# Altium schematic sheet NoiseSource.SchDoc: =prj_title
size A4; Organization1: Sciences of Technology Buchs; CheckedBy: tbd; CompanyName: OST; Organization: OST Ostschweizer Fachhochschule; Address1: Werdenbergstrasse 4; Address2: 9471 Buchs; Address3: Switzerland; SheetNumber: 1; SheetTotal: 1; Size: A4; ShortDescription: 16 GHz Noise Source
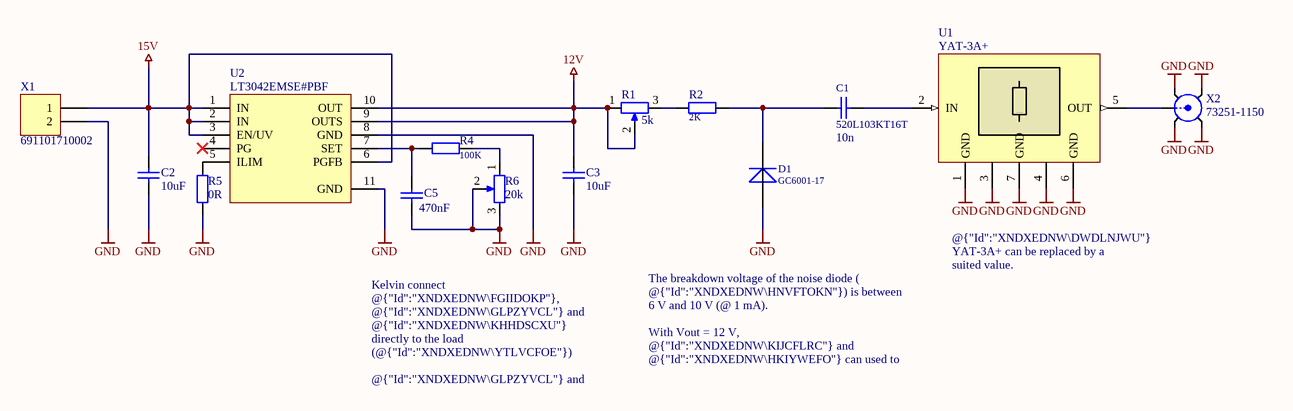
[diagram p0: NoiseSource.SchDoc]

## Parts
C1  520L103KT16T  ShortDescription: 10n  [CAP-0402[1005] - RFL]
C2  ShortDescription: 10uF  [Generic_Cap0603_2_RW]  (hidden comment: GRM188R61E106KA73D)
C3  ShortDescription: 10uF  [Generic_Cap0603_2_RW]  (hidden comment: GRM188R61E106KA73D)
C5  ShortDescription: 470nF  [Generic_Cap0603_2_RW]  (hidden comment: UMK107B7474KA-TR)
D1  GC6001-17  [Microsemi_GC6001-17_2]
R1  ShortDescription: 5k  [BOURNS_3312_3]  (hidden comment: 3312J-1-502E)
R2  value 2K  [RES-0603[1608] - RFL]  (hidden comment: 2K 1% 0603(1608))
R4  value 100K  [RES-0603[1608] - RFL]  (hidden comment: 100K 1% 0603(1608))
R5  0R  [Generic_Res0603_2_RW]
R6  ShortDescription: 20k  [BOURNS_3312_3]  (hidden comment: 3312J-1-203E)
U1  YAT-3A+  [MiniCircuit_MC1630_R]
U2  LT3042EMSE#PBF  [ANALOG_MSOP10_11]
X1  691101710002  [WURTH_691101710002_2_RWH]
X2  73251-1150  [Amphenol_SMA-EDGE-MOUNT_3_H]

## Nets
12V: C3.2 R1.1(TOP) R1.2(TAP) U2.9(OUTS) U2.10(OUT)
15V: C2.2 U2.1(IN) U2.2(IN) U2.3(EN/UV) U2.6(PGFB) X1.1
GND: C2.1 C3.1 C5.2 D1.2(A) R5.2 R6.2(TAP) R6.3(BOT) U1.1(GND) U1.3(GND) U1.4(GND) U1.6(GND) U1.7(GND) U2.8(GND) U2.11(GND) X1.2 X2.2 X2.3 X2.4 X2.5
NetC1_1: C1.1 U1.2(IN)
NetC1_2: C1.2 D1.1(K) R2.1
NetC5_1: C5.1 R4.1 U2.7(SET)
NetR1_3: R1.3(BOT) R2.2
NetR4_2: R4.2 R6.1(TOP)
NetR5_1: R5.1 U2.5(ILIM)
NetU1_5: U1.5(OUT) X2.1

Not connected (* = marked no-connect by the designer): U2 4(PG)*

## Notes on the sheet
- @{"Id":"XNDXEDNW\DWDLNJWU"}  YAT-3A+ can be replaced by a suited value.
- Kelvin connect @{"Id":"XNDXEDNW\FGIIDOKP"}, @{"Id":"XNDXEDNW\GLPZYVCL"} and @{"Id":"XNDXEDNW\KHHDSCXU"} directly to the load (@{"Id":"XNDXEDNW\YTLVCFOE"})
  @{"Id":"XNDXEDNW\GLPZYVCL"} and @{"Id":"XNDXEDNW\KHHDSCXU"} can adjust the output voltage between 10 V and 12 V
  Vout = 100 uA * (@{"Id":"XNDXEDNW\GLPZYVCL"} + @{"Id":"XNDXEDNW\KHHDSCXU"})
- The breakdown voltage of the noise diode ( @{"Id":"XNDXEDNW\HNVFTOKN"}) is between 6 V and 10 V (@ 1 mA).
  With Vout = 12 V, @{"Id":"XNDXEDNW\KIJCFLRC"} and @{"Id":"XNDXEDNW\HKIYWEFO"} can used to configure this current.
- Title:
- Description:
- Size:
- Date:
- Name:
- Number:
- Time:
- Revision:
- Sheet
- Checked:
- of
- File:

## Library data of the parts
C1 = KRSA-0004-A.3: 10n, X7R, 10%, 16V, 16kHz - 16GHz, 0402; Manufacturer: ATC; Manufacturer PartNr: 520L103KT16T
C2 C3 = Baugruppenfertigung-0041-A.5: 10uF, X5R, 10%, 25V; Manufacturer: Murata; Manufacturer PartNr: GRM188R61E106KA73D
C5 = Baugruppenfertigung-0043-A.5: 470nF, X7R, 10%, 50V; Manufacturer: Taiyo Yuden; Manufacturer PartNr: UMK107B7474KA-TR
D1 = KRSA-0002-A.3: Microwave Noise Diode, 0.1 - 18 GHz; Manufacturer: Microchip; ShortDescription: GC6001; Manufacturer PartNr: GC6001-17
R1 = KRSA-0069-A.1: SMD Trimmer, 5k, 2mm; Manufacturer: Bourns; Manufacturer PartNr: 3312J-1-502E
R2 = PassResBas0603-00828-A.2: 2K 0.1W 1% 0603 (1608 Metric)  SMD; ValueAddON: 1% 0.1W; #SubClass: Resistor SMD; #Class: Passiv-Components; Status: nLager
R4 = PassResBas0603-00141-A.2: 100K 0.1W 1% 0603 (1608 Metric)  SMD; ValueAddON: 1% 0.1W; #SubClass: Resistor SMD; #Class: Passiv-Components; Status: nLager
R5 = Baugruppenfertigung-0009-A.3: 0R, 1%, 0603; Manufacturer: Generic; Manufacturer PartNr: 0R; ShortDescription: 0R
R6 = KRSA-0029-A.1: SMD Trimmer, 20k, 2mm; Manufacturer: Bourns; Manufacturer PartNr: 3312J-1-203E
U1 = KRSA-0067-A.1: Fixed Attenuator, DC - 18 GHz, 50R, 3dB, 2W; Manufacturer: MiniCircuits; ShortDescription: YAT-3A+; Manufacturer PartNr: YAT-3A+
U2 = KRSA-0064-A.1: 20V, 200mA, Ultralow Noise, Ultrahigh PSRR RF Linear Regulator, ADJ; Manufacturer: Analog; ShortDescription: LT3042; Manufacturer PartNr: LT3042EMSE#PBF
X1 = KRSA-0042-A.1: Screw Terminal, 2 Pos, 5 mm; Manufacturer: Wurth; ShortDescription: Screw Terminal 2 Pos; Manufacturer PartNr: 691101710002
X2 = 00000_Hilti_Localisation_MA-0044-A.5: SMA, Female, 1.5mm Edge Mount; Manufacturer: Molex; ShortDescription: SMA; Manufacturer PartNr: 73251-1150